# EasyEDA Pro project iQuete_SD_r1.epro

# Schematic Schematic1
Board Name: Board1; Create Date: 2026-03-22; Page Name: P1; Project Name: iQuete_SD_r1; Schematic Name: Schematic1; Update Date: 2026-03-22; Company: EasyEDA.com; Page Size: A4; Version: V1.0
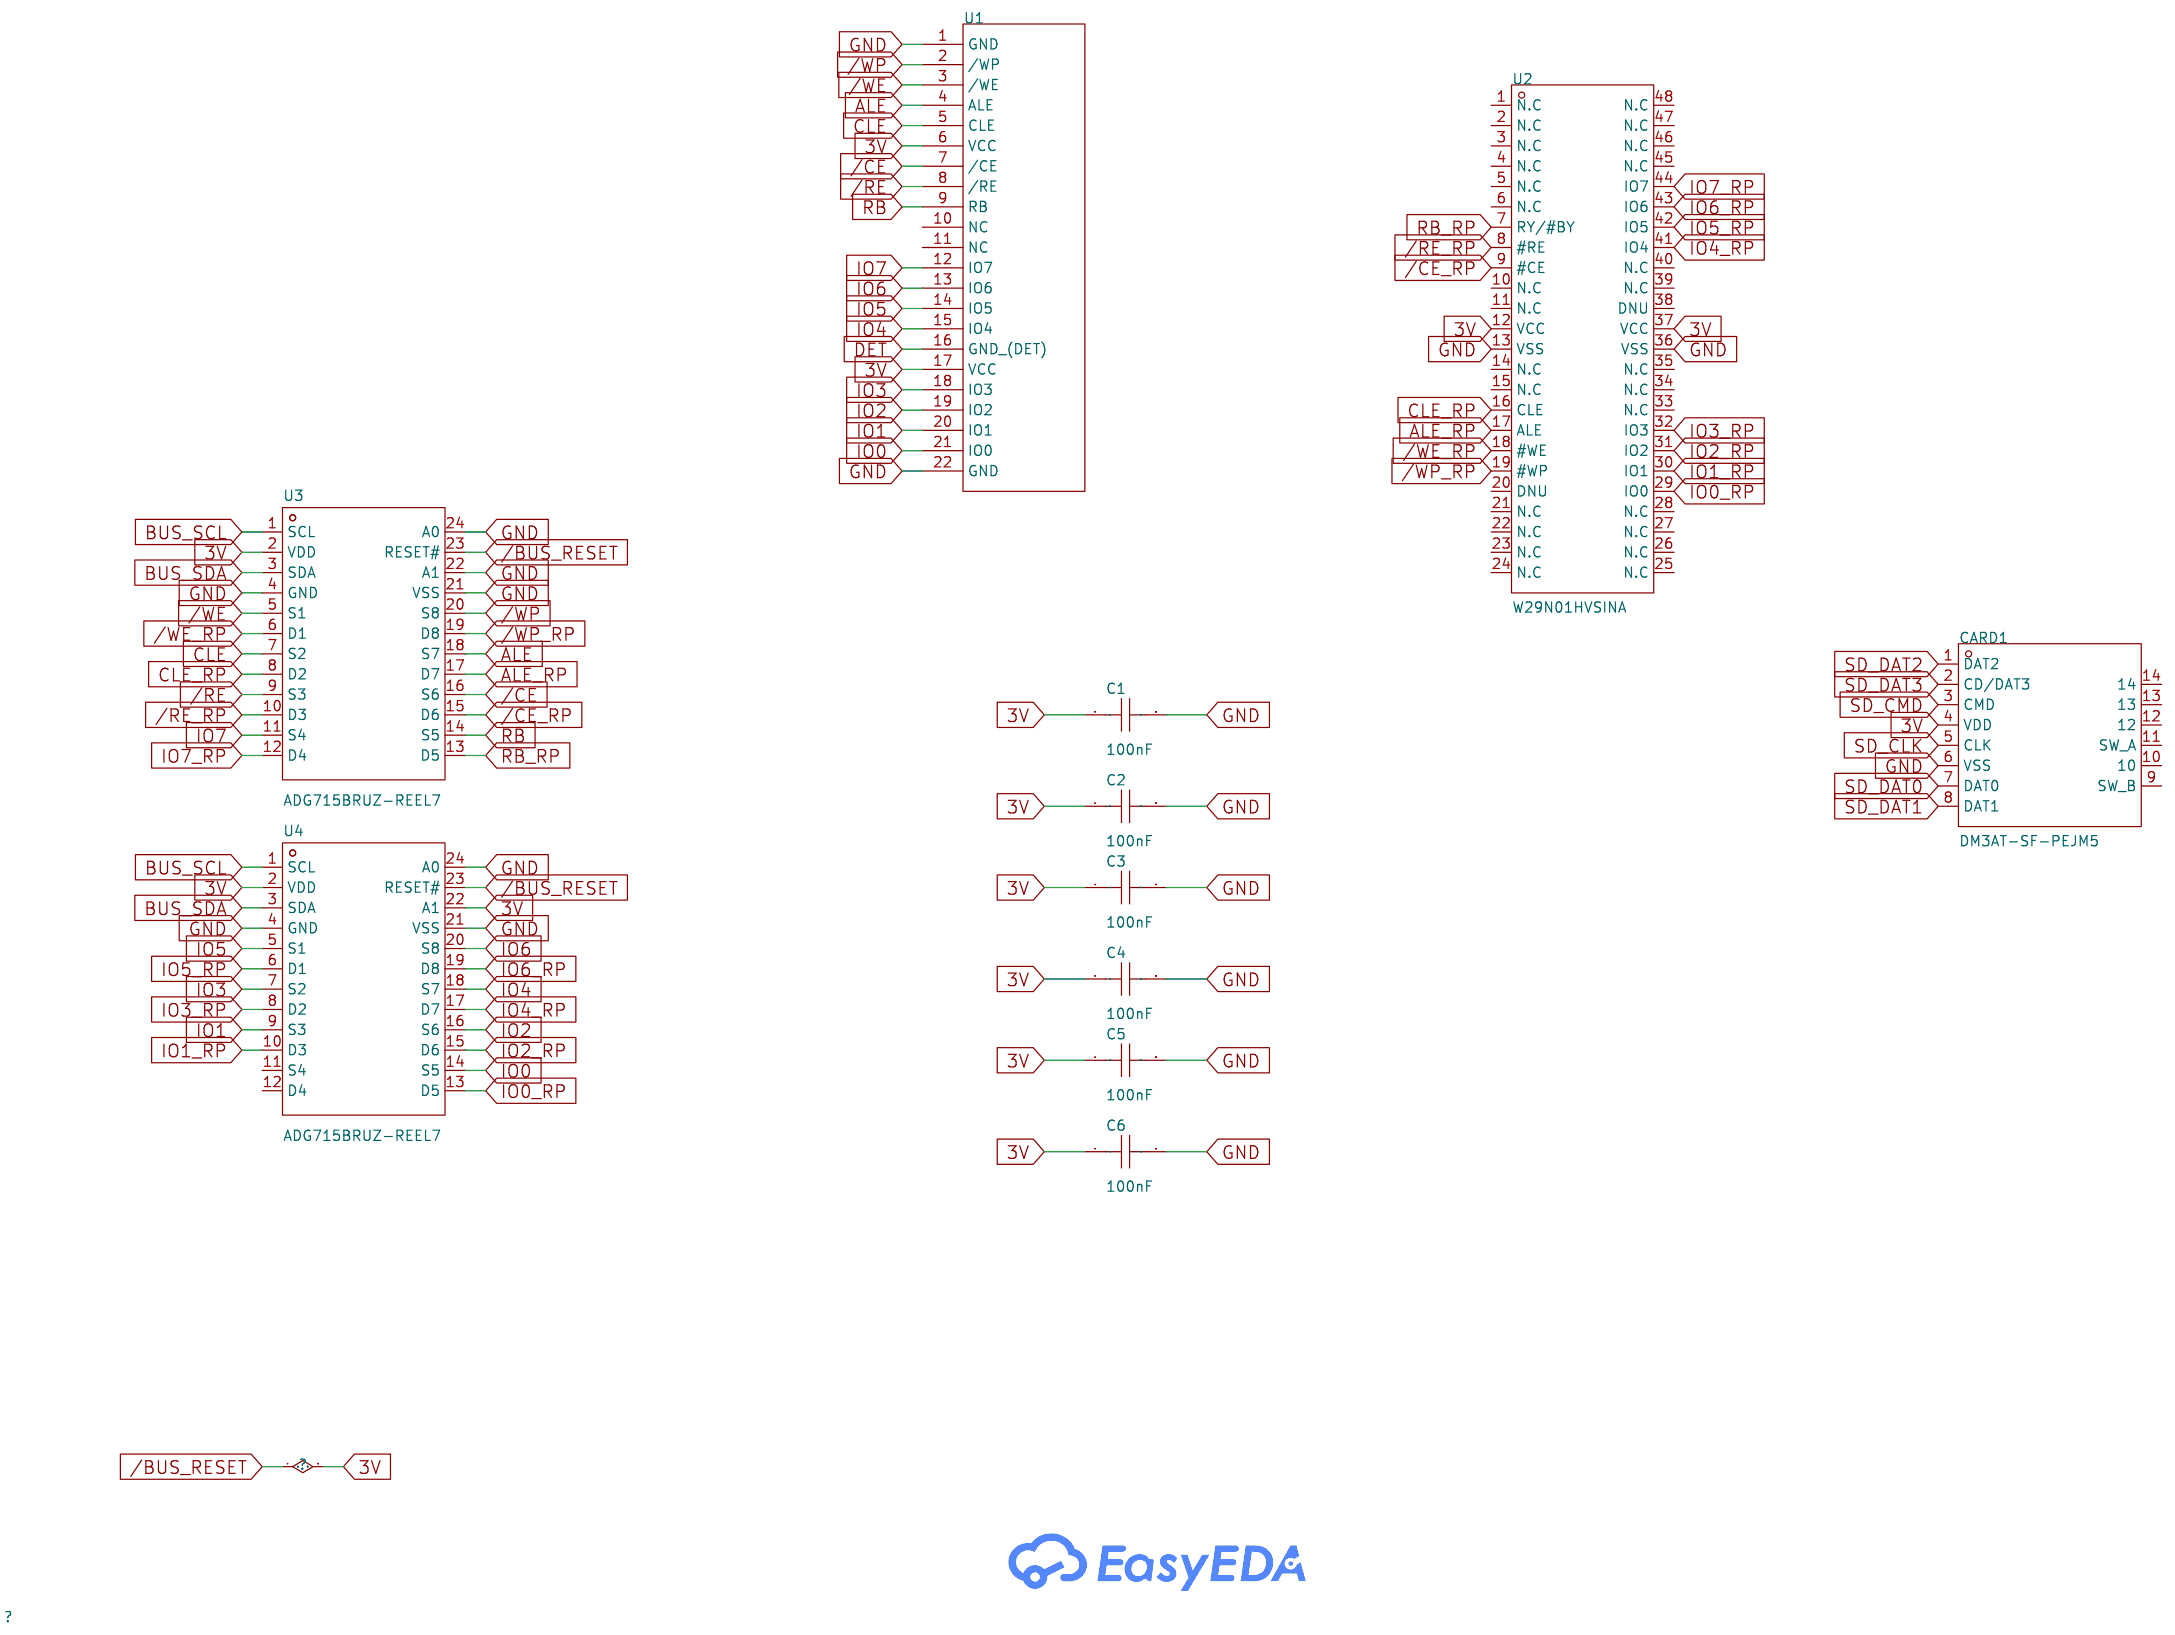
[diagram p0: schematic sheet]

## Parts
C1  100nF  [C0805]
C2  100nF  [C0805]
C3  100nF  [C0805]
C4  100nF  [C0805]
C5  100nF  [C0805]
C6  100nF  [C0805]
CARD1  DM3AT-SF-PEJM5  [SD-SMD_DM3AT-SF-PEJM5]
U1  -  [dookie_cartedge]
U2  W29N01HVSINA  [TSOP-48_L12.0-W18.4-P0.50-LS20.0-TL]
U3  ADG715BRUZ-REEL7  [TSSOP-24_L7.8-W4.4-P0.65-LS6.4-BL]
U4  ADG715BRUZ-REEL7  [TSSOP-24_L7.8-W4.4-P0.65-LS6.4-BL]

## Library data of the parts
C1-C6 = CC0805KRX7R9BB104: Capacitance:100nF Tolerance:±10% Tolerance:±10% Voltage Rating:50V Temperature Coefficient:X7R; LCSC Part Name: 100nF ±10% 50V; Supplier Part: C49678; Manufacturer: YAGEO(国巨); Supplier Footprint: 0805; JLCPCB Part Class: Basic Part; Datasheet: https://item.szlcsc.com/datasheet/CC0805KRX7R9BB104/50686.html; Supplier: LCSC; Tolerance: ±10%; Voltage Rating: 50V; Temperature Coefficient: X7R
CARD1 = DM3AT-SF-PEJM5: Card Connection Mode:Push-Push Card Type:MicroSD Card (TF Card) Connector Type:Connector and Ejector Additional Card Detection Pins:No Supplementary Features:- Height Above Board:1.68mm Operating Temperature:-25℃~+85℃ Operating Temperature:-25℃~+85℃; LCSC Part Name: 自弹式 MicroSD卡(TF卡) 卡座; Supplier Part: C114218; Manufacturer: HRS(广濑); Supplier Footprint: SMD; JLCPCB Part Class: Extended Part; Datasheet: https://item.szlcsc.com/datasheet/DM3AT-SF-PEJM5/115458.html; Supplier: LCSC; Card Connection Mode: Push-Push; Card Type: MicroSD Card (TF Card); Connector Type: Connector and Ejector; Additional Card Detection Pins: No; Height Above Board: 1.68mm; Operating Temperature: -25℃~+85℃
U1 = dookie_cart_edge
U2 = W29N01HVSINA: Supplier Part: C129399; Manufacturer: WINBOND(华邦); Supplier Footprint: TSOP-48-18.4mm; JLCPCB Part Class: Extended Part; Datasheet: https://atta.szlcsc.com/upload/public/pdf/source/20190529/C129399_79A61850C6368522C00650D136159CD5.pdf; Supplier: LCSC
U3 U4 = ADG715BRUZ-REEL7: Switch Circuit:SPST(SPST) Number of Channels:8 Voltage - Supply:2.7V~5.5V Voltage - Supply:2.7V~5.5V Turn-on time:200ns RDS(on):12Ω Turn-off time:190ns Operating Temperature:-40℃~+85℃ Operating Temperature:-40℃~+85℃; LCSC Part Name: ADG714/ADG715 CMOS,低电压,串行控制,八通道SPST开关; Supplier Part: C29471; Manufacturer: ADI(亚德诺); Supplier Footprint: TSSOP-24; JLCPCB Part Class: Extended Part; Datasheet: https://item.szlcsc.com/datasheet/ADG715BRUZ-REEL7/30225.html; Supplier: LCSC; Switch Circuit: SPST(SPST); Number of Channels: 8; Voltage - Supply: 2.7V~5.5V; Turn-on time: 200ns; RDS(on): 12Ω; Turn-off time: 190ns; Operating Temperature: -40℃~+85℃

## Nets
GND: C1.2 C2.2 C3.2 C4.2 C5.2 C6.2 CARD1.6(VSS) U1.1(GND) U1.22(GND) U2.13(VSS) U2.36(VSS) U3.4(GND) U3.21(VSS) U3.22(A1) U3.24(A0) U4.4(GND) U4.21(VSS) U4.24(A0)
/BUS_RESET: C1.1 C2.1 C3.1 C4.1 C5.1 C6.1 CARD1.4(VDD) U1.6(VCC) U1.17(VCC) U2.12(VCC) U2.37(VCC) U3.2(VDD) U3.23(RESET#) U4.2(VDD) U4.22(A1) U4.23(RESET#)
/CE: U1.7(/CE) U3.16(S6)
/CE_RP: U2.9(#CE) U3.15(D6)
/RE: U1.8(/RE) U3.9(S3)
/RE_RP: U2.8(#RE) U3.10(D3)
/WE: U1.3(/WE) U3.5(S1)
/WE_RP: U2.18(#WE) U3.6(D1)
/WP: U1.2(/WP) U3.20(S8)
/WP_RP: U2.19(#WP) U3.19(D8)
ALE: U1.4(ALE) U3.18(S7)
ALE_RP: U2.17(ALE) U3.17(D7)
BUS_SCL: U3.1(SCL) U4.1(SCL)
BUS_SDA: U3.3(SDA) U4.3(SDA)
CLE: U1.5(CLE) U3.7(S2)
CLE_RP: U2.16(CLE) U3.8(D2)
DET: U1.16(GND (DET))
IO0: U1.21(IO0) U4.14(S5)
IO0_RP: U2.29(IO0) U4.13(D5)
IO1: U1.20(IO1) U4.9(S3)
IO1_RP: U2.30(IO1) U4.10(D3)
IO2: U1.19(IO2) U4.16(S6)
IO2_RP: U2.31(IO2) U4.15(D6)
IO3: U1.18(IO3) U4.7(S2)
IO3_RP: U2.32(IO3) U4.8(D2)
IO4: U1.15(IO4) U4.18(S7)
IO4_RP: U2.41(IO4) U4.17(D7)
IO5: U1.14(IO5) U4.5(S1)
IO5_RP: U2.42(IO5) U4.6(D1)
IO6: U1.13(IO6) U4.20(S8)
IO6_RP: U2.43(IO6) U4.19(D8)
IO7: U1.12(IO7) U3.11(S4)
IO7_RP: U2.44(IO7) U3.12(D4)
RB: U1.9(RB) U3.14(S5)
RB_RP: U2.7(RY/#BY) U3.13(D5)
SD_CLK: CARD1.5(CLK)
SD_CMD: CARD1.3(CMD)
SD_DAT0: CARD1.7(DAT0)
SD_DAT1: CARD1.8(DAT1)
SD_DAT2: CARD1.1(DAT2)
SD_DAT3: CARD1.2(CD/DAT3)

Not connected (* = marked no-connect by the designer): CARD1 9(SW_B) 10 11(SW_A) 12 13 14; U1 10(NC) 11(NC); U2 1(N.C) 2(N.C) 3(N.C) 4(N.C) 5(N.C) 6(N.C) 10(N.C) 11(N.C) 14(N.C) 15(N.C) 20(DNU) 21(N.C) 22(N.C) 23(N.C) 24(N.C) 25(N.C) 26(N.C) 27(N.C) 28(N.C) 33(N.C) 34(N.C) 35(N.C) 38(DNU) 39(N.C) 40(N.C) 45(N.C) 46(N.C) 47(N.C) 48(N.C); U4 11(S4) 12(D4)
